# Altium schematic sheet SD Card.SchDoc
size A4
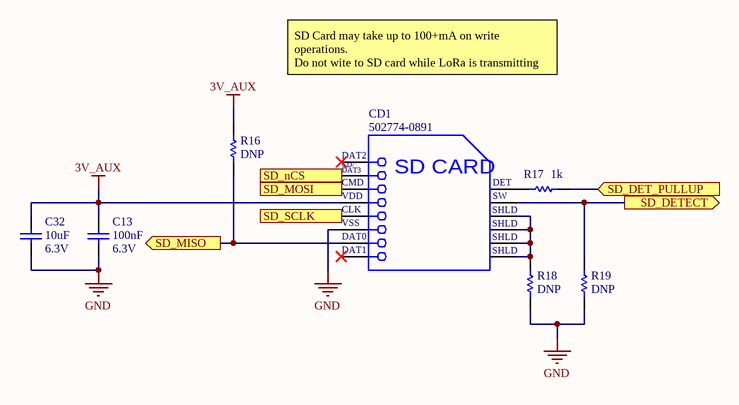
[diagram p0: SD Card.SchDoc]

## Parts
C13  value 100nF  Voltage: 6.3V  [0603 (1608M)]  (hidden comment: Cap)
C32  value 10uF  Voltage: 6.3V  [0603 (1608M)]  (hidden comment: Cap)
CD1  502774-0891  [MOLX-502774-0891_V]
R16  value DNP  [0603 (1608M)]  (hidden comment: Resistor)
R17  value 1k  [0603 (1608M)]  (hidden comment: Resistor)
R18  value DNP  [0603 (1608M)]  (hidden comment: Resistor)
R19  value DNP  [0603 (1608M)]  (hidden comment: Resistor)

## Ports
SD_DET_PULLUP (in), SD_DETECT (out), SD_MISO (out), SD_MOSI (in), SD_nCS (in), SD_SCLK (in)

## Nets
3V_AUX: C13.2 C32.2 CD1.4(VDD) R16.2
GND: C13.1 C32.1 CD1.6(VSS) R18.1 R19.1
SD_DET_PULLUP: R17.1 ; port SD_DET_PULLUP
SD_DETECT: CD1.10(SWITCH) R19.2 ; port SD_DETECT
SD_MISO: CD1.7(DAT0) R16.1 ; port SD_MISO
SD_MOSI: CD1.3(CMD) ; port SD_MOSI
SD_nCS: CD1.2(CD/DAT3) ; port SD_nCS
SD_SCLK: CD1.5(CLK) ; port SD_SCLK
NetCD1_9: CD1.9(DETECT) R17.2
NetCD1_11: CD1.11(SHLD) CD1.12(SHLD) CD1.13(SHLD) CD1.14(SHLD) R18.2

Not connected (* = marked no-connect by the designer): CD1 1(DAT2)* 8(DAT1)*

## Notes on the sheet
- SD Card may take up to 100+mA on write operations.
  Do not wite to SD card while LoRa is transmitting
- (in symbol CMP-2000-05248-1) CD/; DAT3; SD CARD; DET; SW

## Library data of the parts
C13 C32 = Cap: Capacitor
CD1 = CMP-2000-05248-1: Micro SD Memory Card Connector, 0.5 A, 10 V (DC), -25 to 85 degC, 8-Pin SMT, RoHS, Tape and Reel; Manufacturer: Molex; 3D Model: 502774-0891.stp; Online Catalog: microSD™Series; Number of Positions: 10(8+2); Card Type: SecureDigital-microSD™; Insertion, Removal Method: PushIn,PushOut; Other Names: WM24066DKR; Connector Type: ConnectorandEjector; Features: Switch; Family: MemoryConnectors-PCCardSockets; Manufacturer URL: http://www.molex.com/; Mounting Type: SurfaceMount,RightAngle; Contact Finish Thickness: 20µin(0.51µm); Standard Package: 1; Series: 502774; Ejector Side: -; Datasheet Version: Rev. D, 04/2004; Category: Connectors,Interconnects; Contact Finish: Gold; Datasheet URL: https://datasheet.ciiva.com/1104/1499551-1104671.pdf; RoHS Information: 502774-0891CertofCompliance; Mounting Feature: Reverse-Bottom; Packaging: Digi-Reel; Height Above Board: 0.071"(1.80mm); Catalog Drawings: 502774-0891
R16-R19 = Resistor: Tolerance: 5%; Published: 8-Jun-2000; LatestRevisionDate: 17-Jul-2002; LatestRevisionNote: Re-released for DXP Platform.; PackageReference: AXIAL-0.3; Publisher: Altium Limited; PackageDescription: Axial Device, Thru-Hole; 2 Leads; 0.3 in Pin Spacing